# Altium schematic sheet Com_Uart.SchDoc
size A3; CompanyName: Ok's Lab; Engineer: Oktay Topcu; SheetNumber: 5; SheetTotal: 7; UniqueID: 20200803; X2: A3; X3: 20200803; X4: r1.0; X6: 5; X7: 7; X8: Com_Uart.SchDoc
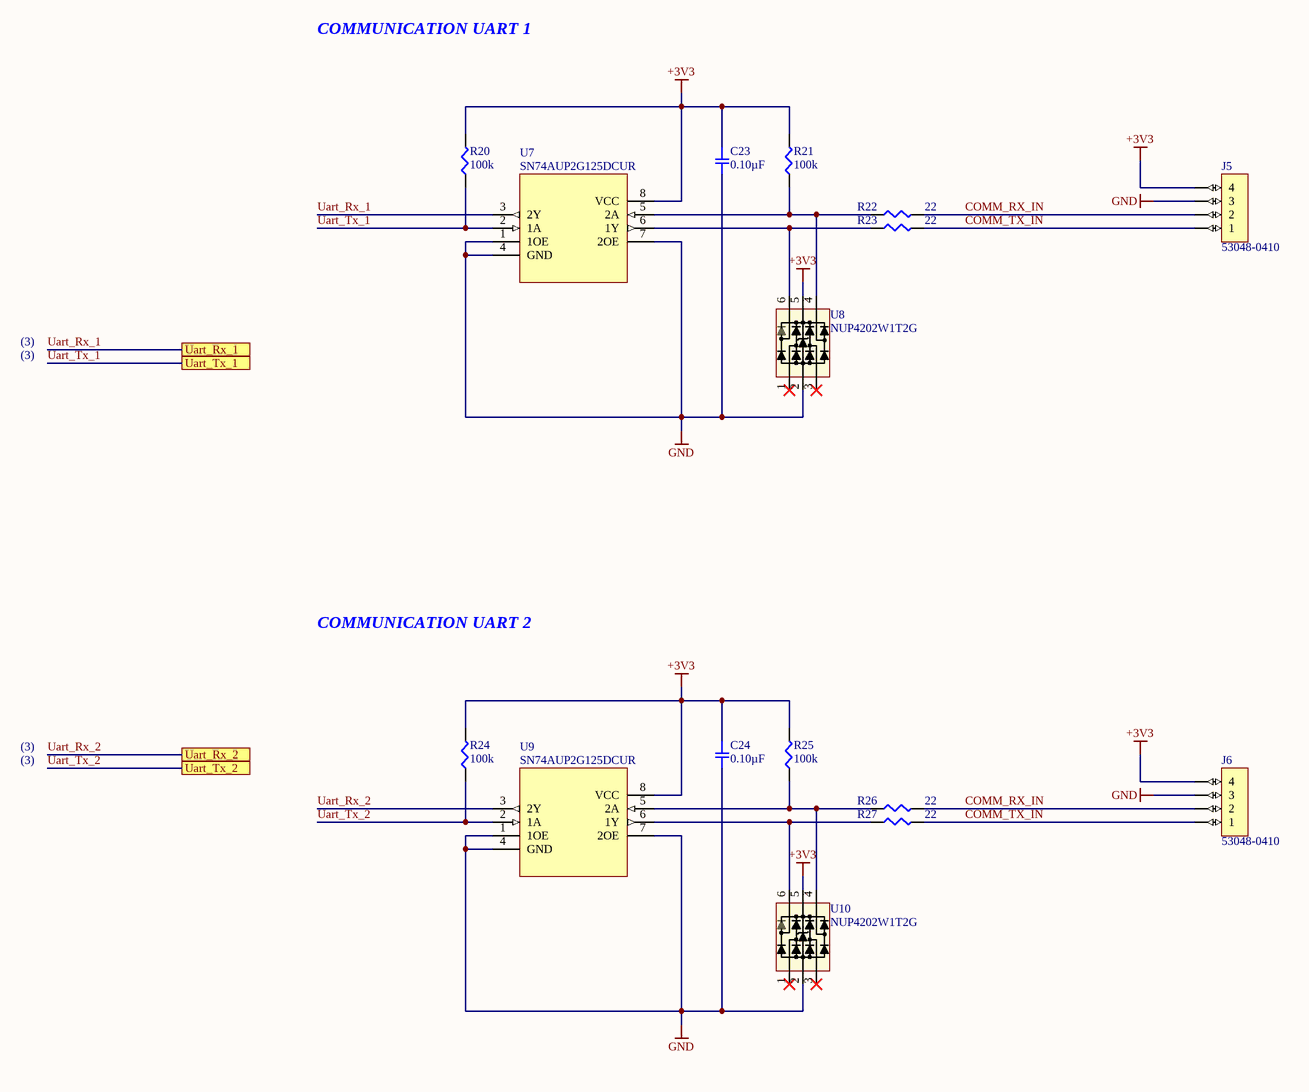
[diagram p0: Com_Uart.SchDoc]

## Parts
C23  0.10µF  [SMD-0603C]
C24  0.10µF  [SMD-0603C]
J5  53048-0410  [CONN_4_POS__0530480410]
J6  53048-0410  [CONN_4_POS__0530480410]
R20  100k  [SMD-0603-RES]
R21  100k  [SMD-0603-RES]
R22  22  [SMD-0603-RES]
R23  22  [SMD-0603-RES]
R24  100k  [SMD-0603-RES]
R25  100k  [SMD-0603-RES]
R26  22  [SMD-0603-RES]
R27  22  [SMD-0603-RES]
U7  SN74AUP2G125DCUR  [VFSOP_8]
U8  NUP4202W1T2G  [SOT-363]
U9  SN74AUP2G125DCUR  [VFSOP_8]
U10  NUP4202W1T2G  [SOT-363]

## Ports
Uart_Rx_1, Uart_Rx_2, Uart_Tx_1, Uart_Tx_2

## Nets
+3V3: C23.1 C24.1 J5.4 J6.4 R20.2 R21.2 R24.2 R25.2 U7.8(VCC) U8.5 U9.8(VCC) U10.5
GND: C23.2 C24.2 J5.3 J6.3 U7.1(1OE) U7.4(GND) U7.7(2OE) U8.2 U9.1(1OE) U9.4(GND) U9.7(2OE) U10.2
COMM_RX_IN: J5.2 J6.2 R22.2 R26.2
COMM_TX_IN: J5.1 J6.1 R23.2 R27.2
Uart_Rx_1: U7.3(2Y) ; port Uart_Rx_1
Uart_Rx_2: U9.3(2Y) ; port Uart_Rx_2
Uart_Tx_1: R20.1 U7.2(1A) ; port Uart_Tx_1
Uart_Tx_2: R24.1 U9.2(1A) ; port Uart_Tx_2
NetR21_1: R21.1 R22.1 U7.5(2A) U8.4
NetR23_1: R23.1 U7.6(1Y) U8.6
NetR25_1: R25.1 R26.1 U9.5(2A) U10.4
NetR27_1: R27.1 U9.6(1Y) U10.6

Not connected (* = marked no-connect by the designer): U8 1* 3*; U10 1* 3*

## Notes on the sheet
- COMMUNICATION UART 1
- (3)
- COMMUNICATION UART 2
- Title
- Size:
- Date:
- Number:
- Revision:
- Sheet
- of
- File:

## Library data of the parts
C23 C24 = GCJ188R71H104KA12D: CAP CER 0.1UF 50V X7R 0603; Manufacturer: Murata Electronics North America; Factory Stock: 0; Unit Price (USD): 0.12; Minimum Quantity: 1; Tolerance: ±10%; Datasheets: http://www.murata.com/~/media/webrenewal/support/library/catalog/products/capacitor/mlcc/c03e.ashx; Image: //media.digikey.com/Renders/Murata%20Renders/0603%28LQG18%29.jpg; Digi-Key Part Number: 490-5798-1-ND; Quantity Available: 163695; @ qty: 0; Packaging: Cut Tape (CT); Series: GCJ; Part Status: Active; Value: 0.10µF; Voltage: 50V; Temperature Coefficient: X7R; Operating Temperature: -55°C ~ 125°C; Features: Soft Termination; Ratings: AEC-Q200; Applications: Automotive, Boardflex Sensitive; Mounting Type: Surface Mount, MLCC; Package / Case: 0603 (1608 Metric); Size / Dimension: 0.063" L x 0.031" W (1.60mm x 0.80mm); Height - Seated (Max): -; Thickness (Max): 0.035" (0.90mm); Lead Spacing: -; Lead Style: -; Manufacturer Part Number: GCJ188R71H104KA12D
J5 J6 = CONN_4_POS__0530480410: CONN HEADER R/A 4POS 1.25MM; Manufacturer: Molex; Contact Resistance: 20mR; Current Rating: 1A; Voltage Rating: 125V; Number of Positions: 4; Insulation Resistance: 100MR; Gender: Male; Connector Type: Blade Pin; Glow Wire Compliant: Non-compliant; Supplier 1: Avnet; Manufacturer Part Number: 53048-0410; Stock 1: 44; Pricing 1: 1=0.1232 (USD); Mount: Through Hole; Case/Package: 0410; Contact Material: Bronze,Tin; Contact Plating: Tin; Color: Natural; Housing Color: Natural; Housing Material: Nylon; Min Operating Temperature: -40°C; Max Operating Temperature: 85°C; Package Quantity: 5000; Number of Rows: 1; Packaging: Tray; Contact Gender: Male; Termination: Solder; Number of Contacts: 4; Orientation: Right Angle; Number of Circuits: 4; Voltage Rating (DC): 125V; Series: PicoBlade; Contact Type: Blade Pin; Pitch: 1.25mm; Depth: 5.5mm; Radiation Hardening: No; REACH SVHC: Unknown; Lead Free: Lead Free; Flammability Rating: UL94 V-0; RoHS Compliant: Yes; ComponentLink1URL: https://www.distrelec.biz/Web/Downloads/60/_e/gg116847-116860_e.pdf?mime=application%2Fpdf&src-supplier=Distrelec; ComponentLink1Description: https://www.distrelec.biz/Web/Downloads/60/_e/gg116847-116860_e.pdf?mime=application%2Fpdf&src-supplier=Distrelec; ComponentLink2URL: http://uk.rs-online.com/webdocs/1362/0900766b81362ba7.pdf?src-supplier=RSComponents; ComponentLink2Description: http://uk.rs-online.com/webdocs/1362/0900766b81362ba7.pdf?src-supplier=RSComponents; ComponentLink3URL: http://www.molex.com/webdocs/datasheets/pdf/en-us/0530480410_PCB_HEADERS.pdf?src-supplier=Avnet; ComponentLink3Description: http://www.molex.com/webdocs/datasheets/pdf/en-us/0530480410_PCB_HEADERS.pdf?src-supplier=Avnet; ComponentLink4URL: http://www.mouser.com/ds/2/276/0530480410_PCB_HEADERS-170930.pdf?src-supplier=Mouser; ComponentLink4Description: http://www.mouser.com/ds/2/276/0530480410_PCB_HEADERS-170930.pdf?src-supplier=Mouser; Supplier Part Number 1: 53048-0410
R20 R21 R24 R25 = ERJ-3EKF1003V: RES SMD 100K OHM 1% 1/10W 0603; Manufacturer: Panasonic Electronic Components; Factory Stock: 0; Unit Price (USD): 0.00379; @ qty: 1500; Minimum Quantity: 1; Power (Watts): 0.1W, 1/10W; Temperature Coefficient: ±100ppm/°C; Part Number: ERJ-3EKF1003V; Datasheets: http://industrial.panasonic.com/www-cgi/jvcr13pz.cgi?E+PZ+3+AOA0002+ERJ3EKF1003V+7+WW; Image: //media.digikey.com/Photos/Panasonic%20Photos/MFG_ERJ-P6W%20Series.jpg; Digi-Key Part Number: P100KHCT-ND; Quantity Available: 2179804; Packaging: Cut Tape (CT); Series: ERJ; Part Status: Active; Value: 100k; Tolerance: ±1%; Composition: Thick Film; Features: Automotive AEC-Q200; Operating Temperature: -55°C ~ 155°C; Package / Case: 0603 (1608 Metric); Supplier Device Package: 0603; Size / Dimension: 0.063" L x 0.031" W (1.60mm x 0.80mm); Height - Seated (Max): 0.022" (0.55mm); Number of Terminations: 2; Failure Rate: -
R22 R23 R26 R27 = ERJ-3EKF22R0V: RES SMD 22 OHM 1% 1/10W 0603; Manufacturer: Panasonic Electronic Components; Factory Stock: 0; Unit Price (USD): 0.00379; @ qty: 1500; Minimum Quantity: 1; Power (Watts): 0.1W, 1/10W; Temperature Coefficient: ±100ppm/°C; Part Number: ERJ-3EKF22R0V; Datasheets: http://industrial.panasonic.com/www-cgi/jvcr13pz.cgi?E+PZ+3+AOA0002+ERJ3EKF22R0V+7+WW; Image: //media.digikey.com/Photos/Panasonic%20Photos/MFG_ERJ-P6W%20Series.jpg; Digi-Key Part Number: P22.0HCT-ND; Quantity Available: 100321; Packaging: Cut Tape (CT); Series: ERJ; Part Status: Active; Value: 22; Tolerance: ±1%; Composition: Thick Film; Features: Automotive AEC-Q200; Operating Temperature: -55°C ~ 155°C; Package / Case: 0603 (1608 Metric); Supplier Device Package: 0603; Size / Dimension: 0.063" L x 0.031" W (1.60mm x 0.80mm); Height - Seated (Max): 0.022" (0.55mm); Number of Terminations: 2; Failure Rate: -
U7 U9 = SN74AUP2G125DCUR: Low-Power Dual Bus Buffer Gate With 3-State Outputs 8-VSSOP -40 to 85; Manufacturer: Texas Instruments; Max Supply Voltage: 3.6V; Min Supply Voltage: 800mV; Propagation Delay: 6.5ns; Number of Elements: 2; Logic Function: Buffer,Inverting; Low Level Output Current: 4mA; Number of Input Lines: 4; Polarity: Non-Inverting; Number of Bits per Element: 1; High Level Output Current: -4mA; Quiescent Current: 500nA; Supplier 1: Avnet; Manufacturer Part Number: SN74AUP2G125DCUR; Stock 1: 0; Mount: Surface Mount; Case/Package: VSSOP; Number of Pins: 8; Min Operating Temperature: -40°C; Max Operating Temperature: 85°C; Package Quantity: 3000; Packaging: Tape and Reel; Number of Channels: 2; Number of Inputs: 2; Number of Outputs: 2; Number of Output Lines: 4; Number of Bits: 2; Output Type: 3-STATE; Series: 74AUP; Technology: CMOS; Lead Free: Lead Free; RoHS Compliant: Yes; ComponentLink1URL: http://www.ti.com/lit/ds/symlink/sn74aup2g125.pdf?src-supplier=Digi-Key; ComponentLink1Description: http://www.ti.com/lit/ds/symlink/sn74aup2g125.pdf?src-supplier=Digi-Key; ComponentLink2URL: http://www.ti.com/general/docs/lit/getliterature.tsp?genericPartNumber=SN74AUP2G125&&fileType=pdf&src-supplier=Avnet; ComponentLink2Description: http://www.ti.com/general/docs/lit/getliterature.tsp?genericPartNumber=SN74AUP2G125&&fileType=pdf&src-supplier=Avnet; Supplier Part Number 1: SN74AUP2G125DCUR
U8 U10 = NUP4202W1T2G: TVS DIODE 5VWM 14.5VC SOT363; Manufacturer: ON Semiconductor; Capacitance @ Frequency: 3pF @ 1MHz; Voltage - Reverse Standoff (Typ): 5V (Max); Voltage - Breakdown (Min): 6V; Power Line Protection: No; Current - Peak Pulse (10/1000µs): 28A (8/20µs); Power - Peak Pulse: 500W; Voltage - Clamping (Max) @ Ipp: 14.5V (Typ); Type: Steering (Rail to Rail); Operating Temperature: -40°C ~ 125°C (TJ); Supplier: Digi-Key; Applications: General Purpose; Manufacturer Part Number: NUP4202W1T2G; Packaging: Cut Tape (CT); Package / Case: 6-TSSOP, SC-88, SOT-363; Mounting Type: Surface Mount; RoHS: RoHS Compliant; Category: Circuit Protection; Supplier Device Package: SC-88/SC70-6/SOT-363; Part Status: Active; ComponentLink1URL: http://www.onsemi.com/pub_link/Collateral/NUP4202W1-D.PDF; ComponentLink1Description: http://www.onsemi.com/pub_link/Collateral/NUP4202W1-D.PDF; Pricing: 1=0.69, 10=0.595, 100=0.4441, 500=0.34896, 1000=0.26965 (USD); Stock: 8683; Supplier Part Number: NUP4202W1T2GOSCT-ND